# EAGLE schematic loadcell (EAGLE 7.4.0)
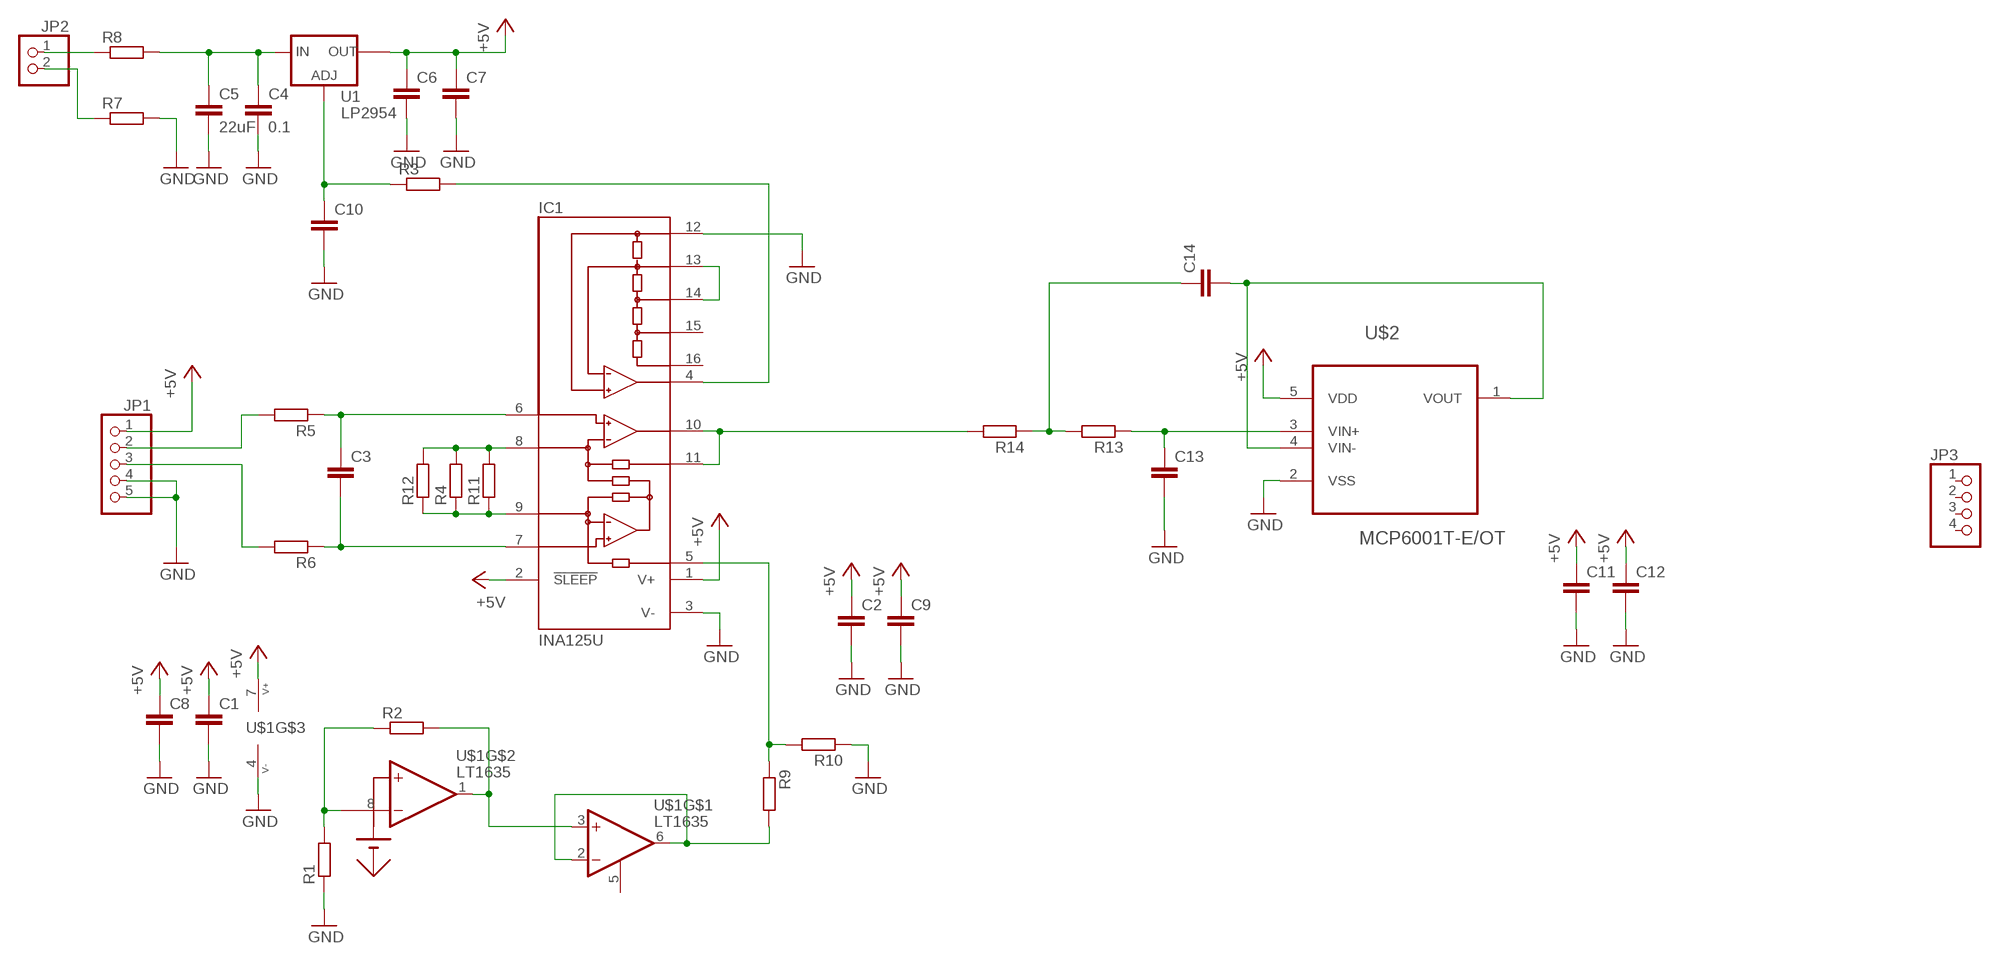
[diagram p0: schematic, sheet 1]

## Parts
C1  C-EUC0805  [C0805]
C2  C-EUC0805  [C0805]
C3  C-EUC0805  [C0805]
C4  0.1  C-EUC0805  [C0805]
C5  22uF  C-EUC0805  [C0805]
C6  C-EUC0805  [C0805]
C7  C-EUC0805  [C0805]
C8  C-EUC0805  [C0805]
C9  C-EUC0805  [C0805]
C10  C-EUC0805  [C0805]
C11  C-EUC0805  [C0805]
C12  C-EUC0805  [C0805]
C13  C-EUC0805  [C0805]
C14  C-EUC0805  [C0805]
IC1  INA125U  [SO16-1]
JP1  PINHD-1X5  [1X05]
JP2  PINHD-1X2  [1X02]
JP3  PINHD-1X4  [1X04]
R1  R-EU_R0805  [R0805]
R2  R-EU_R0805  [R0805]
R3  R-EU_R0805  [R0805]
R4  R-EU_R0805  [R0805]
R5  R-EU_R0805  [R0805]
R6  R-EU_R0805  [R0805]
R7  R-EU_R0805  [R0805]
R8  R-EU_R0805  [R0805]
R9  R-EU_R0805  [R0805]
R10  R-EU_R0805  [R0805]
R11  R-EU_R0805  [R0805]
R12  R-EU_R0805  [R0805]
R13  R-EU_R0805  [R0805]
R14  R-EU_R0805  [R0805]
U1  LP2954  LM1084IS  [TO263]
U$1  LT1635  [SO08]
U$2  MCP6001T-E/OT  [SOT95P270X145-5N]

## Nets
+5V: C1.1 C2.1 C6.1 C7.1 C8.1 C9.1 C11.1 C12.1 IC1.1(V+) IC1.2(!SLEEP) JP1.1 U1.2(OUT) U$1.7(V+) U$2.5(VDD)
GND: C1.2 C2.2 C4.2 C5.2 C6.2 C7.2 C8.2 C9.2 C10.2 C11.2 C12.2 C13.2 IC1.3(V-) IC1.12(REFCOM) JP1.4 JP1.5 R1.1 R7.2 R10.1 U$1.4(V-) U$2.2(VSS)
N$1: R1.2 R2.1 U$1.8(REF_FB)
N$2: R2.2 U$1.1(REF_OUT) U$1.3(+IN)
N$3: R9.2 U$1.2(-IN) U$1.6(OUT)
N$4: IC1.13(REFBG) IC1.14(REF2.5)
N$5: IC1.4(REFOUT) R3.2
N$6: C10.1 R3.1 U1.1(ADJ)
N$7: IC1.10(OUT) IC1.11(SENSE) R14.2
N$8: IC1.8(RG) R4.2 R11.2 R12.2
N$9: IC1.9(RG) R4.1 R11.1 R12.1
N$10: C3.2 IC1.7(-IN) R6.1
N$11: C3.1 IC1.6(+IN) R5.1
N$12: JP2.1 R8.1
N$13: JP2.2 R7.1
N$14: C4.1 C5.1 R8.2 U1.3(IN)
N$15: JP1.2 R5.2
N$16: JP1.3 R6.2
N$17: IC1.5(REF) R9.1 R10.2
N$18: C14.2 U$2.1(VOUT) U$2.4(VIN-)
N$19: C13.1 R13.1 U$2.3(VIN+)
N$20: C14.1 R13.2 R14.1
Unconnected: IC1.15(REF5) IC1.16(REF10) JP3.1 JP3.2 JP3.3 JP3.4 U1.4(OUT4) U$1.5(BAL)

## Library data of the parts
C1-C14 = rcl:C-EU: CAPACITOR, European symbol
IC1 = burr-brown:INA125: Instrumentation Amplifier with Precision Voltage Reference; FARNELL: 2323253
JP1 = pinhead:PINHD-1X5: PIN HEADER
JP2 = pinhead:PINHD-1X2: PIN HEADER
JP3 = pinhead:PINHD-1X4: PIN HEADER
R1-R14 = rcl:R-EU_: RESISTOR, European symbol
U1 = v-reg:LM1084IS: VOLTAGE REGULATOR; FARNELL: 1685547
U$1 = LT1635:LT1635
U$2 = Microchip_By_element14_Batch_1:MCP6001T-E/OT: 1 MHz, Low-Power Op Amp; MPN: MCP6001T-E/OT; OC_FARNELL: 1332116; OC_NEWARK: 34M7471; PACKAGE: SOT23-5; SUPPLIER: Microchip